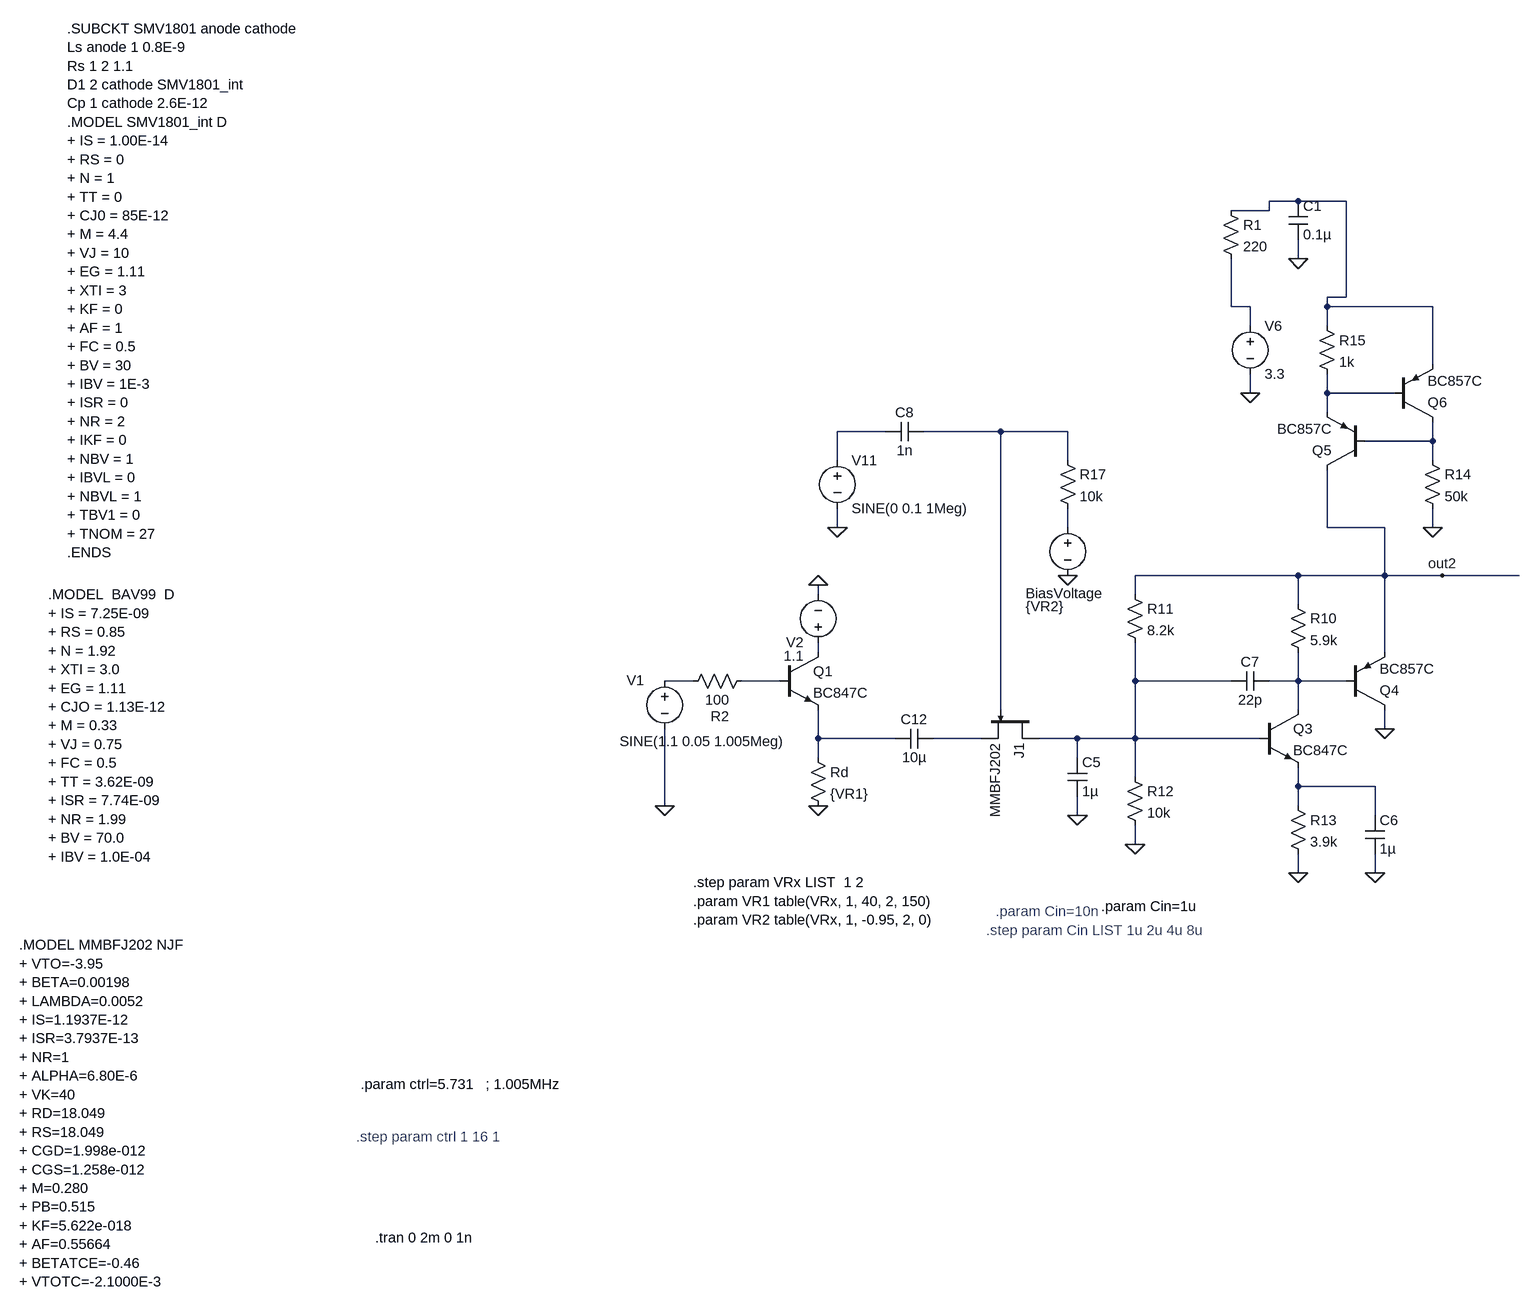
[diagram p0: schematic modified_triode_mixer.asc]
modified_triode_mixer.asc, the LTspice schematic file:
Version 4
SHEET 1 10972 2084
WIRE 1008 -816 960 -816
WIRE 1088 -816 1008 -816
WIRE 960 -800 960 -816
WIRE 960 -800 896 -800
WIRE 1008 -720 1008 -752
WIRE 1088 -656 1088 -816
WIRE 1088 -656 1056 -656
WIRE 896 -640 896 -720
WIRE 928 -640 896 -640
WIRE 1056 -640 1056 -656
WIRE 1232 -640 1056 -640
WIRE 928 -608 928 -640
WIRE 1056 -608 1056 -640
WIRE 1232 -544 1232 -640
WIRE 928 -496 928 -528
WIRE 1056 -496 1056 -528
WIRE 1168 -496 1056 -496
WIRE 1056 -464 1056 -496
WIRE 320 -432 240 -432
WIRE 512 -432 384 -432
WIRE 624 -432 512 -432
WIRE 1232 -416 1232 -448
WIRE 1232 -416 1120 -416
WIRE 240 -384 240 -432
WIRE 624 -384 624 -432
WIRE 1232 -384 1232 -416
WIRE 240 -272 240 -304
WIRE 624 -272 624 -304
WIRE 1056 -272 1056 -368
WIRE 1152 -272 1056 -272
WIRE 1232 -272 1232 -304
WIRE 1008 -192 736 -192
WIRE 1152 -192 1152 -272
WIRE 1152 -192 1008 -192
WIRE 1248 -192 1152 -192
WIRE 1376 -192 1248 -192
WIRE 208 -160 208 -176
WIRE 736 -160 736 -192
WIRE 1008 -144 1008 -192
WIRE 208 -64 208 -80
WIRE 1152 -64 1152 -192
WIRE 0 -16 -48 -16
WIRE 144 -16 80 -16
WIRE 736 -16 736 -80
WIRE 896 -16 736 -16
WIRE 1008 -16 1008 -64
WIRE 1008 -16 960 -16
WIRE 1088 -16 1008 -16
WIRE 512 32 512 -432
WIRE 1008 32 1008 -16
WIRE 1152 64 1152 32
WIRE 208 80 208 32
WIRE 336 80 208 80
WIRE 480 80 400 80
WIRE 640 80 576 80
WIRE 736 80 736 -16
WIRE 736 80 640 80
WIRE 944 80 736 80
WIRE 208 112 208 80
WIRE 640 112 640 80
WIRE 736 144 736 80
WIRE 1008 160 1008 128
WIRE 1136 160 1008 160
WIRE -48 192 -48 64
WIRE 1008 192 1008 160
WIRE 640 208 640 176
WIRE 1136 208 1136 160
WIRE 736 256 736 224
WIRE 1008 304 1008 272
WIRE 1136 304 1136 272
FLAG 640 208 0
FLAG 1152 64 0
FLAG 736 256 0
FLAG 928 -496 0
FLAG 1008 304 0
FLAG 1136 304 0
FLAG 1232 -272 0
FLAG 240 -272 0
FLAG 1248 -192 out2
FLAG -48 192 0
FLAG 1008 -720 0
FLAG 208 -176 0
FLAG 208 192 0
FLAG 624 -192 0
DATAFLAG 1232 -416 "$"
DATAFLAG 1248 -224 "$"
SYMBOL njf 576 32 R90
SYMATTR InstName J1
SYMATTR Value MMBFJ202
SYMBOL cap 624 112 R0
SYMATTR InstName C5
SYMATTR Value 1µ
SYMBOL npn 944 32 R0
SYMATTR InstName Q3
SYMATTR Value BC847C
SYMBOL res 992 -160 R0
SYMATTR InstName R10
SYMATTR Value 5.9k
SYMBOL pnp 1088 32 M180
SYMATTR InstName Q4
SYMATTR Value BC857C
SYMBOL res 720 -176 R0
SYMATTR InstName R11
SYMATTR Value 8.2k
SYMBOL res 720 128 R0
SYMATTR InstName R12
SYMATTR Value 10k
SYMBOL voltage 928 -624 R0
SYMATTR InstName V6
SYMATTR Value 3.3
SYMBOL res 992 176 R0
SYMATTR InstName R13
SYMATTR Value 3.9k
SYMBOL cap 1120 208 R0
SYMATTR InstName C6
SYMATTR Value 1µ
SYMBOL pnp 1120 -368 R180
SYMATTR InstName Q5
SYMATTR Value BC857C
SYMBOL pnp 1168 -448 M180
SYMATTR InstName Q6
SYMATTR Value BC857C
SYMBOL res 1216 -400 R0
SYMATTR InstName R14
SYMATTR Value 50k
SYMBOL res 1040 -624 R0
SYMATTR InstName R15
SYMATTR Value 1k
SYMBOL cap 960 -32 R90
WINDOW 0 0 32 VBottom 2
WINDOW 3 32 32 VTop 2
SYMATTR InstName C7
SYMATTR Value 22p
SYMBOL cap 384 -448 R90
WINDOW 0 0 32 VBottom 2
WINDOW 3 32 32 VTop 2
SYMATTR InstName C8
SYMATTR Value 1n
SYMBOL res 608 -400 R0
SYMATTR InstName R17
SYMATTR Value 10k
SYMBOL cap 400 64 R90
WINDOW 0 0 32 VBottom 2
WINDOW 3 32 32 VTop 2
SYMATTR InstName C12
SYMATTR Value 10µ
SYMBOL voltage 240 -400 R0
WINDOW 123 0 0 Left 2
WINDOW 39 0 0 Left 2
SYMATTR InstName V11
SYMATTR Value SINE(0 0.1 1Meg)
SYMBOL voltage -48 -32 R0
WINDOW 123 0 0 Left 2
WINDOW 39 0 0 Left 2
WINDOW 0 -63 15 Left 2
WINDOW 3 -75 117 Left 2
SYMATTR InstName V1
SYMATTR Value SINE(1.1 0.05 1.005Meg)
SYMBOL res 880 -816 R0
SYMATTR InstName R1
SYMATTR Value 220
SYMBOL cap 992 -816 R0
SYMATTR InstName C1
SYMATTR Value 0.1µ
SYMBOL voltage 208 -64 R180
WINDOW 3 24 -6 Left 2
SYMATTR Value 1.1
SYMATTR InstName V2
SYMBOL npn 144 -64 R0
SYMATTR InstName Q1
SYMATTR Value BC847C
SYMBOL res -16 0 R270
WINDOW 0 -59 60 VTop 2
WINDOW 3 0 56 VBottom 2
SYMATTR InstName R2
SYMATTR Value 100
SYMBOL res 192 96 R0
SYMATTR InstName Rd
SYMATTR Value {VR1}
SYMBOL voltage 624 -288 R0
WINDOW 0 -70 126 Left 2
WINDOW 3 -70 148 Left 2
SYMATTR InstName BiasVoltage
SYMATTR Value {VR2}
TEXT -2392 -1104 Left 2 !.SUBCKT SMV1801 anode cathode\nLs anode 1 0.8E-9\nRs 1 2 1.1\nD1 2 cathode SMV1801_int\nCp 1 cathode 2.6E-12\n.MODEL SMV1801_int D\n+ IS = 1.00E-14\n+ RS = 0\n+ N = 1\n+ TT = 0\n+ CJ0 = 85E-12\n+ M = 4.4\n+ VJ = 10\n+ EG = 1.11\n+ XTI = 3\n+ KF = 0\n+ AF = 1\n+ FC = 0.5\n+ BV = 30\n+ IBV = 1E-3\n+ ISR = 0\n+ NR = 2\n+ IKF = 0\n+ NBV = 1\n+ IBVL = 0\n+ NBVL = 1\n+ TBV1 = 0\n+ TNOM = 27\n.ENDS
TEXT -2424 -160 Left 2 !.MODEL  BAV99  D\n+ IS = 7.25E-09\n+ RS = 0.85\n+ N = 1.92\n+ XTI = 3.0\n+ EG = 1.11\n+ CJO = 1.13E-12\n+ M = 0.33\n+ VJ = 0.75\n+ FC = 0.5\n+ TT = 3.62E-09\n+ ISR = 7.74E-09\n+ NR = 1.99\n+ BV = 70.0\n+ IBV = 1.0E-04
TEXT -1056 656 Left 2 !.param ctrl=5.731   ; 1.005MHz
TEXT -1064 744 Left 2 ;.step param ctrl 1 16 1
TEXT -2472 424 Left 2 !.MODEL MMBFJ202 NJF\n+ VTO=-3.95\n+ BETA=0.00198\n+ LAMBDA=0.0052\n+ IS=1.1937E-12\n+ ISR=3.7937E-13\n+ NR=1\n+ ALPHA=6.80E-6\n+ VK=40\n+ RD=18.049\n+ RS=18.049\n+ CGD=1.998e-012\n+ CGS=1.258e-012\n+ M=0.280\n+ PB=0.515\n+ KF=5.622e-018\n+ AF=0.55664\n+ BETATCE=-0.46\n+ VTOTC=-2.1000E-3
TEXT -1032 912 Left 2 !.tran 0 2m 0 1n
TEXT 488 400 Left 2 ;.step param Cin LIST 1u 2u 4u 8u
TEXT 504 368 Left 2 ;.param Cin=10n
TEXT 680 360 Left 2 !.param Cin=1u
TEXT 0 320 Left 2 !.step param VRx LIST  1 2\n.param VR1 table(VRx, 1, 40, 2, 150)\n.param VR2 table(VRx, 1, -0.95, 2, 0)

The netlist it stands for:
* modified_triode_mixer.asc
J1 N011 N005 N014 MMBFJ202
C5 N011 0 1µ
Q3 N012 N011 N015 0 BC847C
R10 out2 N012 5.9k
Q4 0 N012 out2 0 BC857C
R11 out2 N011 8.2k
R12 N011 0 10k
V6 N002 0 3.3
R13 N015 0 3.9k
C6 N015 0 1µ
Q5 out2 N006 N003 0 BC857C
Q6 N006 N003 N001 0 BC857C
R14 N006 0 50k
R15 N001 N003 1k
C7 N012 N011 22p
C8 N005 N004 1n
R17 N005 N007 10k
C12 N014 N013 10µ
V11 N004 0 SINE(0 0.1 1Meg)
V1 N009 0 SINE(1.1 0.05 1.005Meg)
R1 N001 N002 220
C1 N001 0 0.1µ
V2 N008 0 1.1
Q1 N008 N010 N013 0 BC847C
R2 N009 N010 100
Rd N013 0 {VR1}
V§BiasVoltage N007 0 {VR2}
.model NPN NPN
.model PNP PNP
.lib standard.bjt
.model NJF NJF
.model PJF PJF
.lib standard.jft
.SUBCKT SMV1801 anode cathode
Ls anode 1 0.8E-9
Rs 1 2 1.1
D1 2 cathode SMV1801_int
Cp 1 cathode 2.6E-12
.MODEL SMV1801_int D
+ IS = 1.00E-14
+ RS = 0
+ N = 1
+ TT = 0
+ CJ0 = 85E-12
+ M = 4.4
+ VJ = 10
+ EG = 1.11
+ XTI = 3
+ KF = 0
+ AF = 1
+ FC = 0.5
+ BV = 30
+ IBV = 1E-3
+ ISR = 0
+ NR = 2
+ IKF = 0
+ NBV = 1
+ IBVL = 0
+ NBVL = 1
+ TBV1 = 0
+ TNOM = 27
.ENDS
.MODEL  BAV99  D
+ IS = 7.25E-09
+ RS = 0.85
+ N = 1.92
+ XTI = 3.0
+ EG = 1.11
+ CJO = 1.13E-12
+ M = 0.33
+ VJ = 0.75
+ FC = 0.5
+ TT = 3.62E-09
+ ISR = 7.74E-09
+ NR = 1.99
+ BV = 70.0
+ IBV = 1.0E-04
.param ctrl=5.731   ; 1.005MHz
* .step param ctrl 1 16 1
.MODEL MMBFJ202 NJF
+ VTO=-3.95
+ BETA=0.00198
+ LAMBDA=0.0052
+ IS=1.1937E-12
+ ISR=3.7937E-13
+ NR=1
+ ALPHA=6.80E-6
+ VK=40
+ RD=18.049
+ RS=18.049
+ CGD=1.998e-012
+ CGS=1.258e-012
+ M=0.280
+ PB=0.515
+ KF=5.622e-018
+ AF=0.55664
+ BETATCE=-0.46
+ VTOTC=-2.1000E-3
.tran 0 2m 0 1n
* .step param Cin LIST 1u 2u 4u 8u
* .param Cin=10n
.param Cin=1u
.step param VRx LIST  1 2
.param VR1 table(VRx, 1, 40, 2, 150)
.param VR2 table(VRx, 1, -0.95, 2, 0)
.backanno
.end